# Altium project VDMEDA_Main.PrjPcb
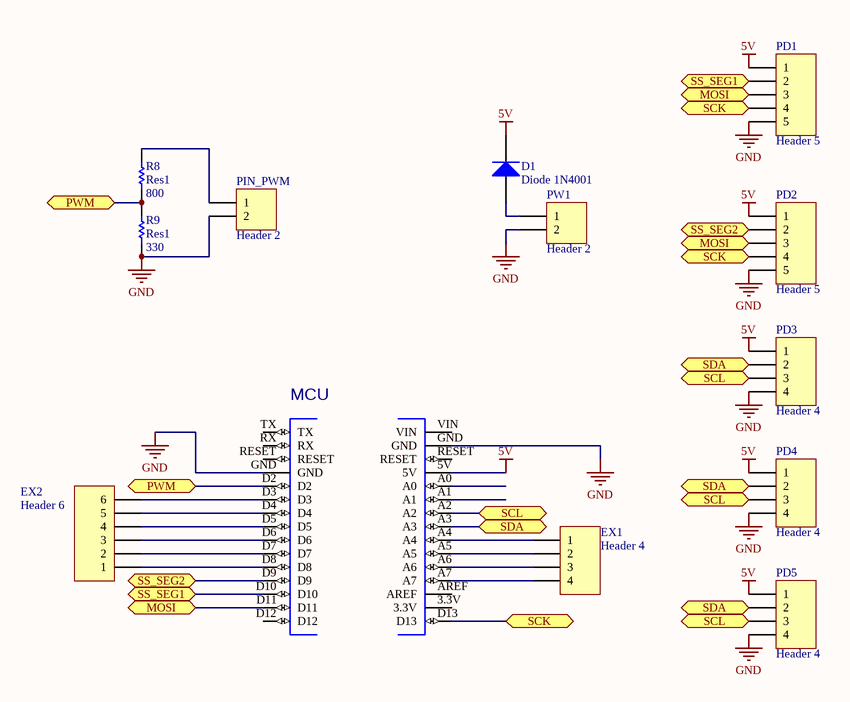
[diagram p0: VDMEDA_Main.SchDoc]
1 sheet, 13 parts. Net scope: flat (ports and power ports of the same name join across sheets).
Board file: VDMEDA_Main.PcbDoc

## Sheet VDMEDA_Main.SchDoc
size A4

### Parts
D1  Diode 1N4001  [DO-41]
EX1  Header 4  [HDR1X4]
EX2  Header 6  [HDR1X6]
MCU  ARDUINO_NANO  [ARDUINO_NANO_ARDUINO_NANO(Primary)]  (value not drawn)
PD1  Header 5  [HDR1X5]
PD2  Header 5  [HDR1X5]
PD3  Header 4  [HDR1X4]
PD4  Header 4  [HDR1X4]
PD5  Header 4  [HDR1X4]
PIN_PWM  Header 2  [TO-220_A]
PW1  Header 2  [TO-220_A]
R8  Res1  value 800  [AXIAL-0.3]
R9  Res1  value 330  [AXIAL-0.3]

### Ports
MOSI (bidir), PWM (bidir), SCK (bidir), SCL (bidir), SDA (bidir), SS_SEG1 (bidir), SS_SEG2 (bidir)

### Nets
5V: D1.2(K) MCU.5V PD1.1 PD2.1 PD3.1 PD4.1 PD5.1
GND: MCU.GND PD1.5 PD2.5 PD3.4 PD4.4 PD5.4 PIN_PWM.2 PW1.2 R9.1
NetD1_1: D1.1(A) PW1.1
NetEX1_1: EX1.1 MCU.A4
NetEX1_2: EX1.2 MCU.A5
NetEX1_3: EX1.3 MCU.A6
NetEX1_4: EX1.4 MCU.A7
NetEX2_1: EX2.1 MCU.D8
NetEX2_2: EX2.2 MCU.D7
NetEX2_3: EX2.3 MCU.D6
NetEX2_4: EX2.4 MCU.D5
NetEX2_5: EX2.5 MCU.D4
NetEX2_6: EX2.6 MCU.D3
NetMCU_A2: MCU.A2 PD3.3 PD4.3 PD5.3 ; port SCL
NetMCU_A3: MCU.A3 PD3.2 PD4.2 PD5.2 ; port SDA
NetMCU_D2: MCU.D2 R8.1 R9.2 ; port PWM
NetMCU_D9: MCU.D9 PD2.2 ; port SS_SEG2
NetMCU_D10: MCU.D10 PD1.2 ; port SS_SEG1
NetMCU_D11: MCU.D11 PD1.3 PD2.3 ; port MOSI
NetMCU_D13: MCU.D13 PD1.4 PD2.4 ; port SCK
NetPIN_PWM_1: PIN_PWM.1 R8.2

Not connected (* = marked no-connect by the designer): MCU 3.3V A0 A1 AREF D12 RESET RX TX VIN

### Library data of the parts
D1 = Diode 1N4001: 1 Amp General Purpose Rectifier; Published: 8-Jun-2000; LatestRevisionDate: 17-Jul-2002; LatestRevisionNote: Re-released for DXP Platform.; DatasheetVersion: 1998; PackageVersion: Aug-1999; PackageReference: DO-41; Publisher: Altium Limited; PackageDescription: Diode, Axial; Body 5.2 x 2.7 mm (LxDia. max), Lead Dia. 0.86 mm (max); Code_JEDEC: DO-204-AL; ComponentLink1Description: Manufacturer Link; ComponentLink1URL: http://www.fairchildsemi.com/; ComponentLink2Description: Datasheet; ComponentLink2URL: http://www.fairchildsemi.com/ds/1N%2F1N4001.pdf
EX1 PD3-PD5 = Header 4: Header, 4-Pin; LatestRevisionDate: 17-Jul-2002; LatestRevisionNote: Re-released for DXP Platform.; Publisher: Altium Limited
EX2 = Header 6: Header, 6-Pin; LatestRevisionDate: 17-Jul-2002; LatestRevisionNote: Re-released for DXP Platform.; Publisher: Altium Limited
PD1 PD2 = Header 5: Header, 5-Pin; LatestRevisionDate: 17-Jul-2002; LatestRevisionNote: Re-released for DXP Platform.; Publisher: Altium Limited
PIN_PWM PW1 = Header 2: Header, 2-Pin; pin to pad: 2>3; LatestRevisionDate: 17-Jul-2002; LatestRevisionNote: Re-released for DXP Platform.; Publisher: Altium Limited
R8 R9 = Res1: Resistor; Published: 8-Jun-2000; LatestRevisionDate: 17-Jul-2002; LatestRevisionNote: Re-released for DXP Platform.; PackageReference: AXIAL-0.3; Publisher: Altium Limited; PackageDescription: Axial Device, Thru-Hole; 2 Leads; 0.3 in Pin Spacing
MCU = ARDUINO_NANO: Value: *